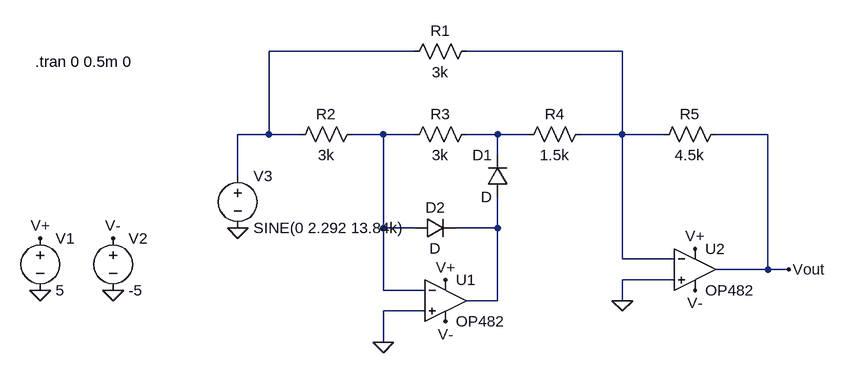
[diagram p0: schematic Etaj4TRANS.asc]
Etaj4TRANS.asc, the LTspice schematic file:
Version 4.1
SHEET 1 880 680
WIRE -320 -112 -544 -112
WIRE 0 -112 -240 -112
WIRE -544 16 -544 -112
WIRE -544 16 -592 16
WIRE -496 16 -544 16
WIRE -368 16 -416 16
WIRE -320 16 -368 16
WIRE -192 16 -240 16
WIRE -144 16 -192 16
WIRE 0 16 0 -112
WIRE 0 16 -64 16
WIRE 64 16 0 16
WIRE 224 16 144 16
WIRE -192 48 -192 16
WIRE -592 80 -592 16
WIRE -368 160 -368 16
WIRE -320 160 -368 160
WIRE -192 160 -192 112
WIRE -192 160 -256 160
WIRE 0 208 0 16
WIRE 80 208 0 208
WIRE 224 224 224 16
WIRE 224 224 144 224
WIRE 256 224 224 224
WIRE 80 240 0 240
WIRE -368 256 -368 160
WIRE -304 256 -368 256
WIRE -192 272 -192 160
WIRE -192 272 -240 272
WIRE 0 272 0 240
WIRE -304 288 -368 288
WIRE -368 336 -368 288
FLAG 0 272 0
FLAG 256 224 Vout
FLAG -896 256 0
FLAG -784 256 0
FLAG -896 176 V+
FLAG -784 176 V-
FLAG 112 192 V+
FLAG 112 256 V-
FLAG -272 240 V+
FLAG -272 304 V-
FLAG -368 336 0
FLAG -592 160 0
SYMBOL res -224 -128 R90
WINDOW 0 0 56 VBottom 2
WINDOW 3 32 56 VTop 2
SYMATTR InstName R1
SYMATTR Value 3k
SYMBOL res -400 0 R90
WINDOW 0 0 56 VBottom 2
WINDOW 3 32 56 VTop 2
SYMATTR InstName R2
SYMATTR Value 3k
SYMBOL res -224 0 R90
WINDOW 0 0 56 VBottom 2
WINDOW 3 32 56 VTop 2
SYMATTR InstName R3
SYMATTR Value 3k
SYMBOL res -48 0 R90
WINDOW 0 0 56 VBottom 2
WINDOW 3 32 56 VTop 2
SYMATTR InstName R4
SYMATTR Value 1.5k
SYMBOL res 160 0 R90
WINDOW 0 0 56 VBottom 2
WINDOW 3 32 56 VTop 2
SYMATTR InstName R5
SYMATTR Value 4.5k
SYMBOL OpAmps\\OP482 -272 208 R0
SYMATTR InstName U1
SYMBOL OpAmps\\OP482 112 160 R0
SYMATTR InstName U2
SYMBOL voltage -896 160 R0
WINDOW 123 0 0 Left 0
WINDOW 39 0 0 Left 0
SYMATTR InstName V1
SYMATTR Value 5
SYMBOL voltage -784 160 R0
SYMATTR InstName V2
SYMATTR Value -5
SYMBOL diode -176 112 R180
WINDOW 0 24 64 Left 2
WINDOW 3 24 0 Left 2
SYMATTR InstName D1
SYMBOL diode -320 176 R270
WINDOW 0 32 32 VTop 2
WINDOW 3 0 32 VBottom 2
SYMATTR InstName D2
SYMBOL voltage -592 64 R0
WINDOW 123 0 0 Left 0
WINDOW 39 0 0 Left 0
SYMATTR InstName V3
SYMATTR Value SINE(0 2.292 13.84k)
TEXT -904 -96 Left 2 !.tran 0 0.5m 0

The netlist it stands for:
* Etaj4TRANS.asc
R1 N002 N001 3k
R2 N003 N001 3k
R3 N004 N003 3k
R4 N002 N004 1.5k
R5 Vout N002 4.5k
X§U1 0 N003 V+ V- N005 OP482  ; pins In+ In- V+ V- OUT
X§U2 0 N002 V+ V- Vout OP482  ; pins In+ In- V+ V- OUT
V1 V+ 0 5
V2 V- 0 -5
D1 N005 N004 D
D2 N003 N005 D
V3 N001 0 SINE(0 2.292 13.84k)
.model D D
.lib standard.dio
.tran 0 0.5m 0
.backanno
.end